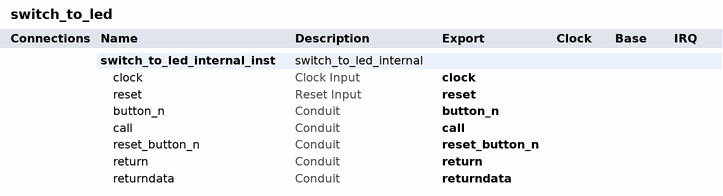
[diagram p0: system contents]
# Platform Designer (Qsys) system switch_to_led, Cyclone V 5CEFA9F23I7
# Parameters at their usual value, and those the tool derives, are not listed.
package require qsys
create_system switch_to_led
set_project_property DEVICE_FAMILY {Cyclone V}
set_project_property DEVICE 5CEFA9F23I7

add_instance switch_to_led_internal_inst switch_to_led_internal 1.0
set_instance_property switch_to_led_internal_inst AUTO_EXPORT true

# exported interfaces
add_interface button_n conduit end
set_interface_property button_n EXPORT_OF switch_to_led_internal_inst.button_n
add_interface call conduit end
set_interface_property call EXPORT_OF switch_to_led_internal_inst.call
add_interface clock clock sink
set_interface_property clock EXPORT_OF switch_to_led_internal_inst.clock
add_interface reset reset sink
set_interface_property reset EXPORT_OF switch_to_led_internal_inst.reset
add_interface reset_button_n conduit end
set_interface_property reset_button_n EXPORT_OF switch_to_led_internal_inst.reset_button_n
add_interface return conduit end
set_interface_property return EXPORT_OF switch_to_led_internal_inst.return
add_interface returndata conduit end
set_interface_property returndata EXPORT_OF switch_to_led_internal_inst.returndata

set_interconnect_requirement {$system} qsys_mm.clockCrossingAdapter HANDSHAKE
set_interconnect_requirement {$system} qsys_mm.enableEccProtection FALSE
set_interconnect_requirement {$system} qsys_mm.insertDefaultSlave FALSE
set_interconnect_requirement {$system} qsys_mm.maxAdditionalLatency 1

save_system switch_to_led.qsys
